# Altium project SMART_HOME.PrjPcb
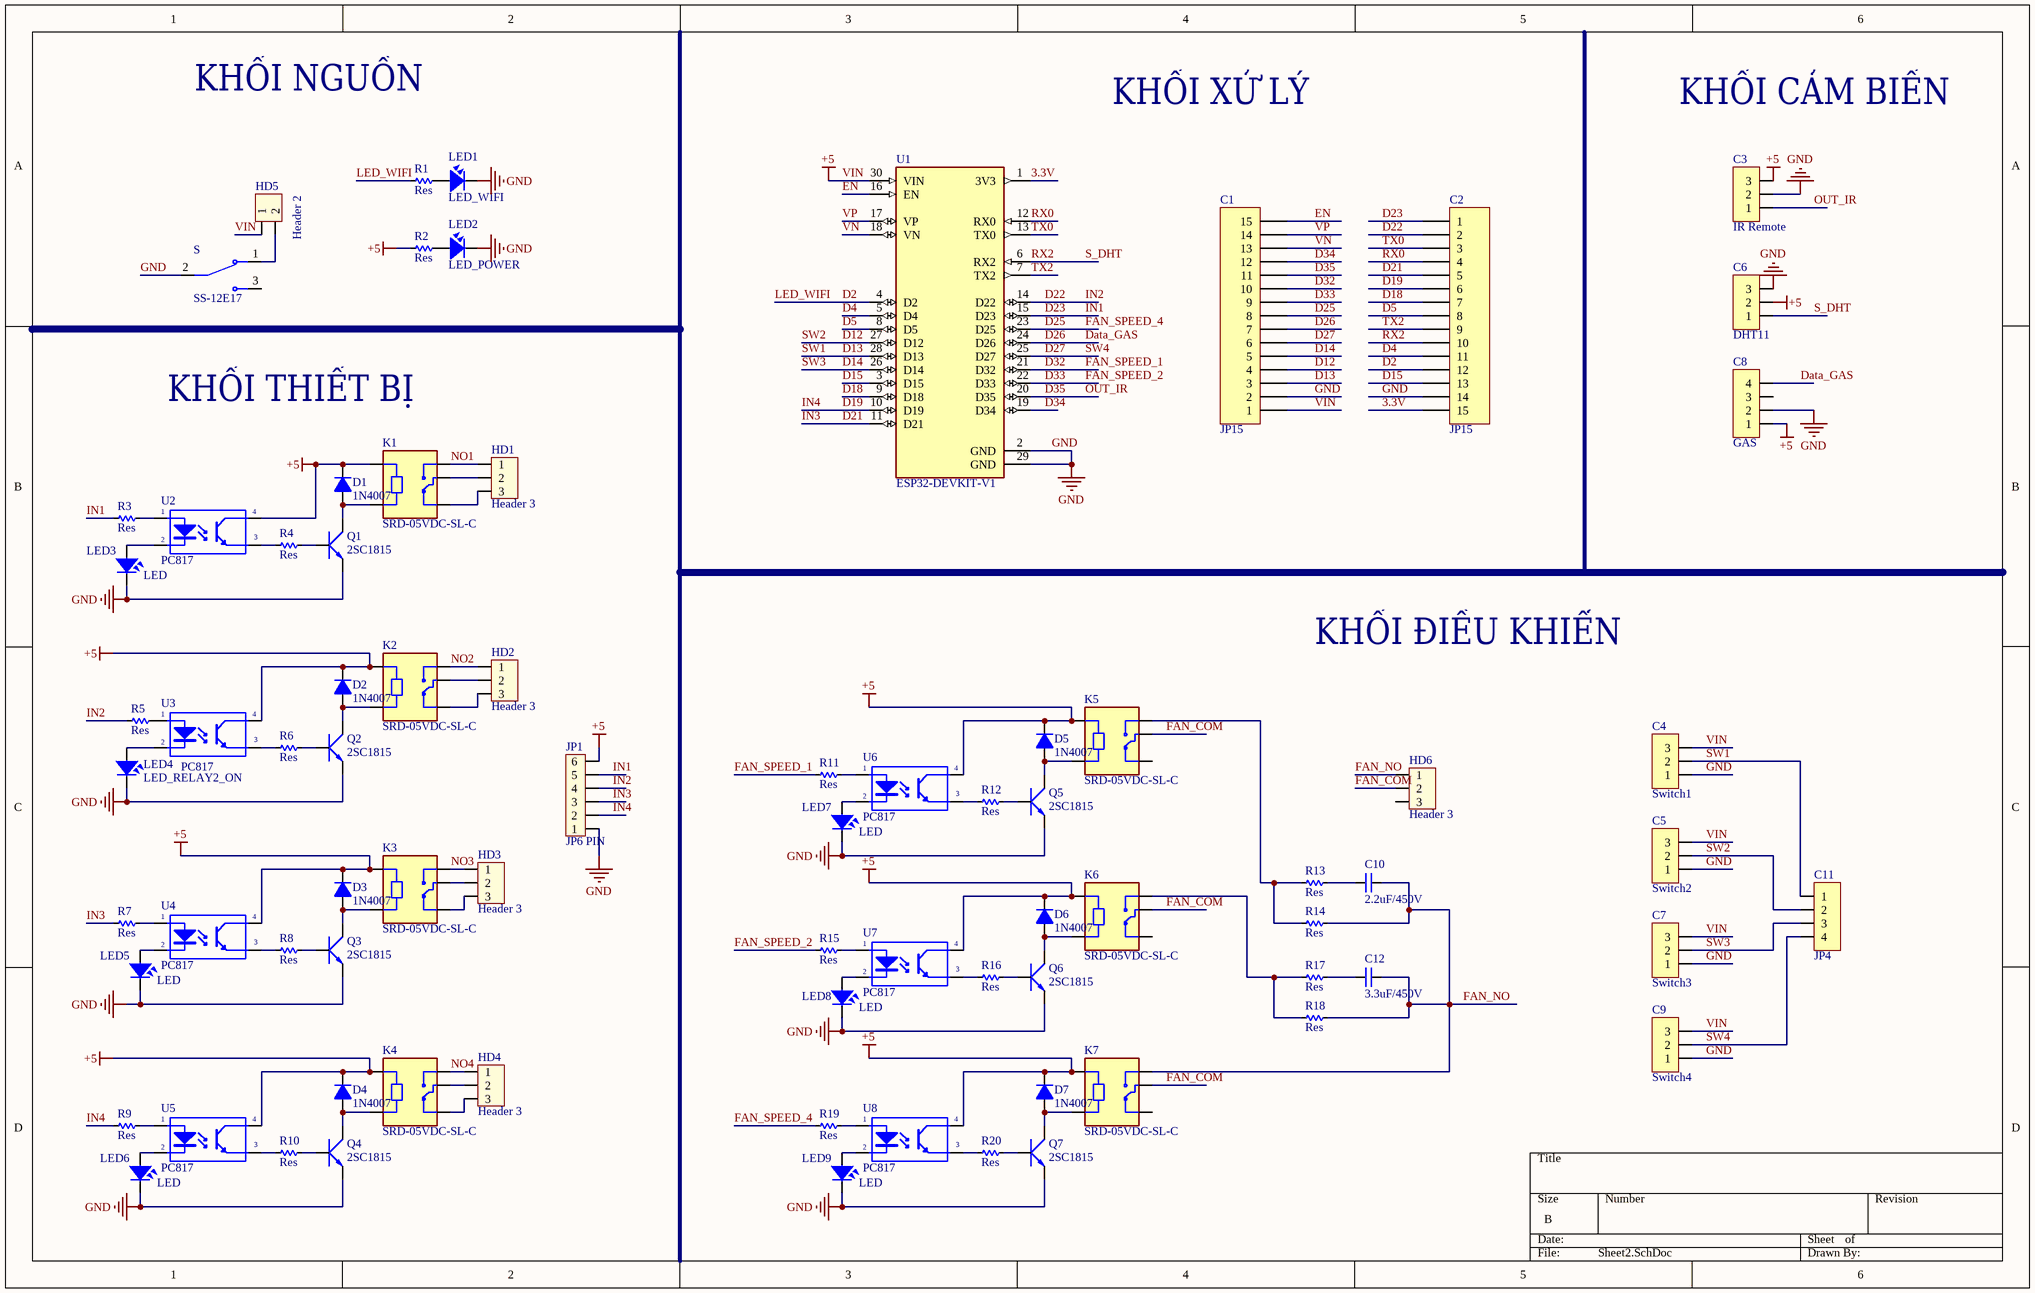
[diagram p0: Sheet2.SchDoc]
1 sheet, 78 parts. Net scope: global (net labels, ports and power ports of the same name join across sheets).
Board file: PCB1.PcbDoc

## Sheet Sheet2.SchDoc
size B; SheetNumber: 1; SheetTotal: 1

### Parts
C1  JP15  [JP15-C1T]
C2  JP15  [JP15-C1T]
C3  IR Remote  [JP3-C1T]
C4  Switch1  [JP3-C1T]
C5  Switch2  [JP3-C1T]
C6  DHT11  [JP3-C1T]
C7  Switch3  [JP3-C1T]
C8  GAS  [JP4-C1T]
C9  Switch4  [JP3-C1T]
C10  2.2uF/450V  [Capacitor_CBB]
C11  JP4  [JP4-C1T]
C12  3.3uF/450V  [Capacitor_CBB]
D1  1N4007  [D1A]
D2  1N4007  [D1A]
D3  1N4007  [D1A]
D4  1N4007  [D1A]
D5  1N4007  [D1A]
D6  1N4007  [D1A]
D7  1N4007  [D1A]
HD1  Header 3  [HED3]
HD2  Header 3  [HED3]
HD3  Header 3  [HED3]
HD4  Header 3  [HED3]
HD5  Header 2  [HED2]
HD6  Header 3  [HED3]
JP1  JP6 PIN  [JP6]
K1  SRD-05VDC-SL-C  [RELAY_SRD-05VDC-SL-C]
K2  SRD-05VDC-SL-C  [RELAY_SRD-05VDC-SL-C]
K3  SRD-05VDC-SL-C  [RELAY_SRD-05VDC-SL-C]
K4  SRD-05VDC-SL-C  [RELAY_SRD-05VDC-SL-C]
K5  SRD-05VDC-SL-C  [RELAY_SRD-05VDC-SL-C]
K6  SRD-05VDC-SL-C  [RELAY_SRD-05VDC-SL-C]
K7  SRD-05VDC-SL-C  [RELAY_SRD-05VDC-SL-C]
LED1  LED_WIFI  [LED-5 GRe]
LED2  LED_POWER  [LED-5 GRe]
LED3  LED  [LED-5 GRe]
LED4  LED_RELAY2_ON  [LED-5 GRe]
LED5  LED  [LED-5 GRe]
LED6  LED  [LED-5 GRe]
LED7  LED  [LED-5 GRe]
LED8  LED  [LED-5 GRe]
LED9  LED  [LED-5 GRe]
Q1  2SC1815  [TO92-123]
Q2  2SC1815  [TO92-123]
Q3  2SC1815  [TO92-123]
Q4  2SC1815  [TO92-123]
Q5  2SC1815  [TO92-123]
Q6  2SC1815  [TO92-123]
Q7  2SC1815  [TO92-123]
R1  Res  [RES-1/4W]
R2  Res  [RES-1/4W]
R3  Res  [RES-1/4W]
R4  Res  [RES-1/4W]
R5  Res  [RES-1/4W]
R6  Res  [RES-1/4W]
R7  Res  [RES-1/4W]
R8  Res  [RES-1/4W]
R9  Res  [RES-1/4W]
R10  Res  [RES-1/4W]
R11  Res  [RES-1/4W]
R12  Res  [RES-1/4W]
R13  Res  [RES-1/4W]
R14  Res  [RES-1/4W]
R15  Res  [RES-1/4W]
R16  Res  [RES-1/4W]
R17  Res  [RES-1/4W]
R18  Res  [RES-1/4W]
R19  Res  [RES-1/4W]
R20  Res  [RES-1/4W]
S  SS-12E17  [SW_SS-12E17]
U1  ESP32-DEVKIT-V1  [MODULE_ESP32_DEVKIT_V1]
U2  PC817  [DIP4/W0.3]
U3  PC817  [DIP4/W0.3]
U4  PC817  [DIP4/W0.3]
U5  PC817  [DIP4/W0.3]
U6  PC817  [DIP4/W0.3]
U7  PC817  [DIP4/W0.3]
U8  PC817  [DIP4/W0.3]

### Nets
GND: C1.2 C2.14 C3.2 C4.1 C5.1 C6.3 C7.1 C8.2 C9.1 JP1.1 LED1.2 LED2.2 LED3.2 LED4.2 LED5.2 LED6.2 LED7.2 LED8.2 LED9.2 Q1.1(E) Q2.1(E) Q3.1(E) Q4.1(E) Q5.1(E) Q6.1(E) Q7.1(E) S.2 U1.2(GND) U1.29(GND)
VIN: C1.1 C3.3 C4.3 C5.3 C6.2 C7.3 C8.1 C9.3 D1.2(K) D2.2(K) D3.2(K) D4.2(K) D5.2(K) D6.2(K) D7.2(K) HD5.1 JP1.6 K1.A1 K2.A1 K3.A1 K4.A1 K5.A1 K6.A1 K7.A1 R2.2 U1.30(VIN) U2.4(C) U3.4(C) U4.4(C) U5.4(C) U6.4(C) U7.4(C) U8.4(C)  [also labelled +5]
3.3V: C2.15 U1.1(3V3)
D2: C2.12 R1.2 U1.4(D2)  [also labelled LED_WIFI]
D4: C2.11 U1.5(D4)
D5: C2.8 U1.8(D5)
D12: C1.4 C5.2 C11.2 U1.27(D12)  [also labelled SW2]
D13: C1.3 C4.2 C11.1 U1.28(D13)  [also labelled SW1]
D14: C1.5 C7.2 C11.3 U1.26(D14)  [also labelled SW3]
D15: C2.13 U1.3(D15)
D18: C2.7 U1.9(D18)
D19: C2.6 JP1.2 R9.2 U1.10(D19)  [also labelled IN4]
D21: C2.5 JP1.3 R7.2 U1.11(D21)  [also labelled IN3]
D22: C2.2 JP1.4 R5.2 U1.14(D22)  [also labelled IN2]
D23: C2.1 JP1.5 R3.2 U1.15(D23)  [also labelled IN1]
D25: C1.8 R19.1 U1.23(D25)  [also labelled FAN_SPEED_4]
D26: C1.7 C8.4 U1.24(D26)  [also labelled Data_GAS]
D27: C1.6 C9.2 C11.4 U1.25(D27)  [also labelled SW4]
D32: C1.10 R11.1 U1.21(D32)  [also labelled FAN_SPEED_1]
D33: C1.9 R15.1 U1.22(D33)  [also labelled FAN_SPEED_2]
D34: C1.12 U1.19(D34)
D35: C1.11 C3.1 U1.20(D35)  [also labelled OUT_IR]
EN: C1.15 U1.16(EN)
FAN_COM: HD6.2 K5.COM K6.COM K7.COM
FAN_NO: C10.1 C12.1 HD6.1 K7.NO R14.2 R18.2
NO1: HD1.1 K1.NO
NO2: HD2.1 K2.NO
NO3: HD3.1 K3.NO
NO4: HD4.1 K4.NO
RX0: C2.4 U1.12(RX0)
RX2: C2.10 C6.1 U1.6(RX2)  [also labelled S_DHT]
TX0: C2.3 U1.13(TX0)
TX2: C2.9 U1.7(TX2)
VN: C1.13 U1.18(VN)
VP: C1.14 U1.17(VP)
NetC10_2: C10.2 R13.2
NetC12_2: C12.2 R17.2
NetD1_1: D1.1(A) K1.A2 Q1.2(C)
NetD2_1: D2.1(A) K2.A2 Q2.2(C)
NetD3_1: D3.1(A) K3.A2 Q3.2(C)
NetD4_1: D4.1(A) K4.A2 Q4.2(C)
NetD5_1: D5.1(A) K5.A2 Q5.2(C)
NetD6_1: D6.1(A) K6.A2 Q6.2(C)
NetD7_1: D7.1(A) K7.A2 Q7.2(C)
NetHD1_2: HD1.2 K1.COM
NetHD1_3: HD1.3 K1.NC
NetHD2_2: HD2.2 K2.COM
NetHD2_3: HD2.3 K2.NC
NetHD3_2: HD3.2 K3.COM
NetHD3_3: HD3.3 K3.NC
NetHD4_2: HD4.2 K4.COM
NetHD4_3: HD4.3 K4.NC
NetHD5_2: HD5.2 S.1
NetK5_NO: K5.NO R13.1 R14.1
NetK6_NO: K6.NO R17.1 R18.1
NetLED1_1: LED1.1 R1.1
NetLED2_1: LED2.1 R2.1
NetLED3_1: LED3.1 U2.2(K)
NetLED4_1: LED4.1 U3.2(K)
NetLED5_1: LED5.1 U4.2(K)
NetLED6_1: LED6.1 U5.2(K)
NetLED7_1: LED7.1 U6.2(K)
NetLED8_1: LED8.1 U7.2(K)
NetLED9_1: LED9.1 U8.2(K)
NetQ1_3: Q1.3(B) R4.2
NetQ2_3: Q2.3(B) R6.2
NetQ3_3: Q3.3(B) R8.2
NetQ4_3: Q4.3(B) R10.2
NetQ5_3: Q5.3(B) R12.2
NetQ6_3: Q6.3(B) R16.2
NetQ7_3: Q7.3(B) R20.2
NetR3_1: R3.1 U2.1(A)
NetR4_1: R4.1 U2.3(E)
NetR5_1: R5.1 U3.1(A)
NetR6_1: R6.1 U3.3(E)
NetR7_1: R7.1 U4.1(A)
NetR8_1: R8.1 U4.3(E)
NetR9_1: R9.1 U5.1(A)
NetR10_1: R10.1 U5.3(E)
NetR11_2: R11.2 U6.1(A)
NetR12_1: R12.1 U6.3(E)
NetR15_2: R15.2 U7.1(A)
NetR16_1: R16.1 U7.3(E)
NetR19_2: R19.2 U8.1(A)
NetR20_1: R20.1 U8.3(E)

Not connected (* = marked no-connect by the designer): C8 3; HD6 3; K5 NC; K6 NC; K7 NC; S 3

### Notes on the sheet
- KHỐI NGUỒN
- KHỐI XỬ LÝ
- KHỐI CẢM BIẾN
- KHỐI THIẾT BỊ
- KHỐI ĐIỀU KHIỂN

### Library data of the parts
C1 C2 = JP15: WR-PHD 2.54 mm Angled Socket Header; Manufacturer: W¨¹rth Elektronik eiSos GmbH; partNo: 613015143121; ComponentLink1 Description: Manufacturer; ComponentLink2 Description: Datasheet; NoPins: 15; Created Date: 29 March 2013; ComponentLink1URL: http://www.we-online.com; ComponentLink2URL: http://katalog.we-online.de/em/datasheet/6130xx143121.pdf; Created by: Karrer Zheng
C3-C7 C9 = JP3: WR-PHD 2.54 mm Angled Socket Header; Manufacturer: W¨¹rth Elektronik eiSos GmbH; partNo: 613003143121; ComponentLink1 Description: Manufacturer; ComponentLink2 Description: Datasheet; NoPins: 03; Created Date: 29 March 2013; ComponentLink1URL: http://www.we-online.com; ComponentLink2URL: http://katalog.we-online.de/em/datasheet/6130xx143121.pdf; Created by: Karrer Zheng
C8 C11 = JP4: WR-PHD 2.54 mm Angled Socket Header; Manufacturer: W¨¹rth Elektronik eiSos GmbH; partNo: 613004143121; ComponentLink1 Description: Manufacturer; ComponentLink2 Description: Datasheet; NoPins: 04; Created Date: 29 March 2013; ComponentLink1URL: http://www.we-online.com; ComponentLink2URL: http://katalog.we-online.de/em/datasheet/6130xx143121.pdf; Created by: Karrer Zheng
C10 C12 = CP9: Cap 10000uF/63V; Value: 220uF/450V
D1-D7 = D1A: Diode 1A; Value: 1N4007
HD1-HD4 HD6 = Hed3: Header 3 (Green); Value: Header 3
HD5 = Hed2: Header 2 (Green); Value: Header 2
JP1 = JP6: Value: JP7
K1-K7 = SRD-05VDC-SL-C: 5V Trigger Relay Module For Arduino And Raspberry Pi 5V Trigger Relay Module For Arduino And Raspberry Pi; MF: Songle Relay; Check_prices: https://www.snapeda.com/parts/SRD-05VDC-SL-C/Songle+Relay/view-part/?ref=eda; Value: *; Availability: Not in stock; Price: None; Package: NON STANDARD-5 Songle Relay; MP: SRD-05VDC-SL-C; SnapEDA_Link: https://www.snapeda.com/parts/SRD-05VDC-SL-C/Songle+Relay/view-part/?ref=snap
LED1-LED9 = LED: LED Single colour Green and Red; Value: LED 3 ly Single Colour
Q1-Q7 = 2SC1815: NPN 600mW, ECB; Value: C1815
R1-R20 = Res: Manufacturer: Generic Components; Class: Passive; SubClass: R; Published: 08/06/2000; Publisher: Altium Hobart Technology Centre
S = SS-12E17: 3-Pin SPDT Slide Switch; MF: Jameco Valuepro; Availability: Unavailable; MP: SS-12E17; Package: None; SnapEDA_Link: https://www.snapeda.com/parts/SS-12E17/Jameco%20Valuepro/view-part/842561/?ref=snap; Value: *; Price: None
U1 = ESP32-DEVKIT-V1: Dual core, Wi-Fi: 2.4 GHz up to 150 Mbits/s,BLE (Bluetooth Low Energy) and legacy Bluetooth, 32 bits, Up to 240 MHz; MF: Do it; Price: None; Availability: Not in stock; Package: None; MP: ESP32-DEVKIT-V1; Value: *; SnapEDA_Link: https://www.snapeda.com/parts/ESP32-DEVKIT-V1/Do+it/view-part/?ref=snap; Check_prices: https://www.snapeda.com/parts/ESP32-DEVKIT-V1/Do+it/view-part/?ref=eda
U2-U8 = PC817: Single Opto; Value: PC817